# EAGLE design Armadino-v152 (EAGLE 5.07)
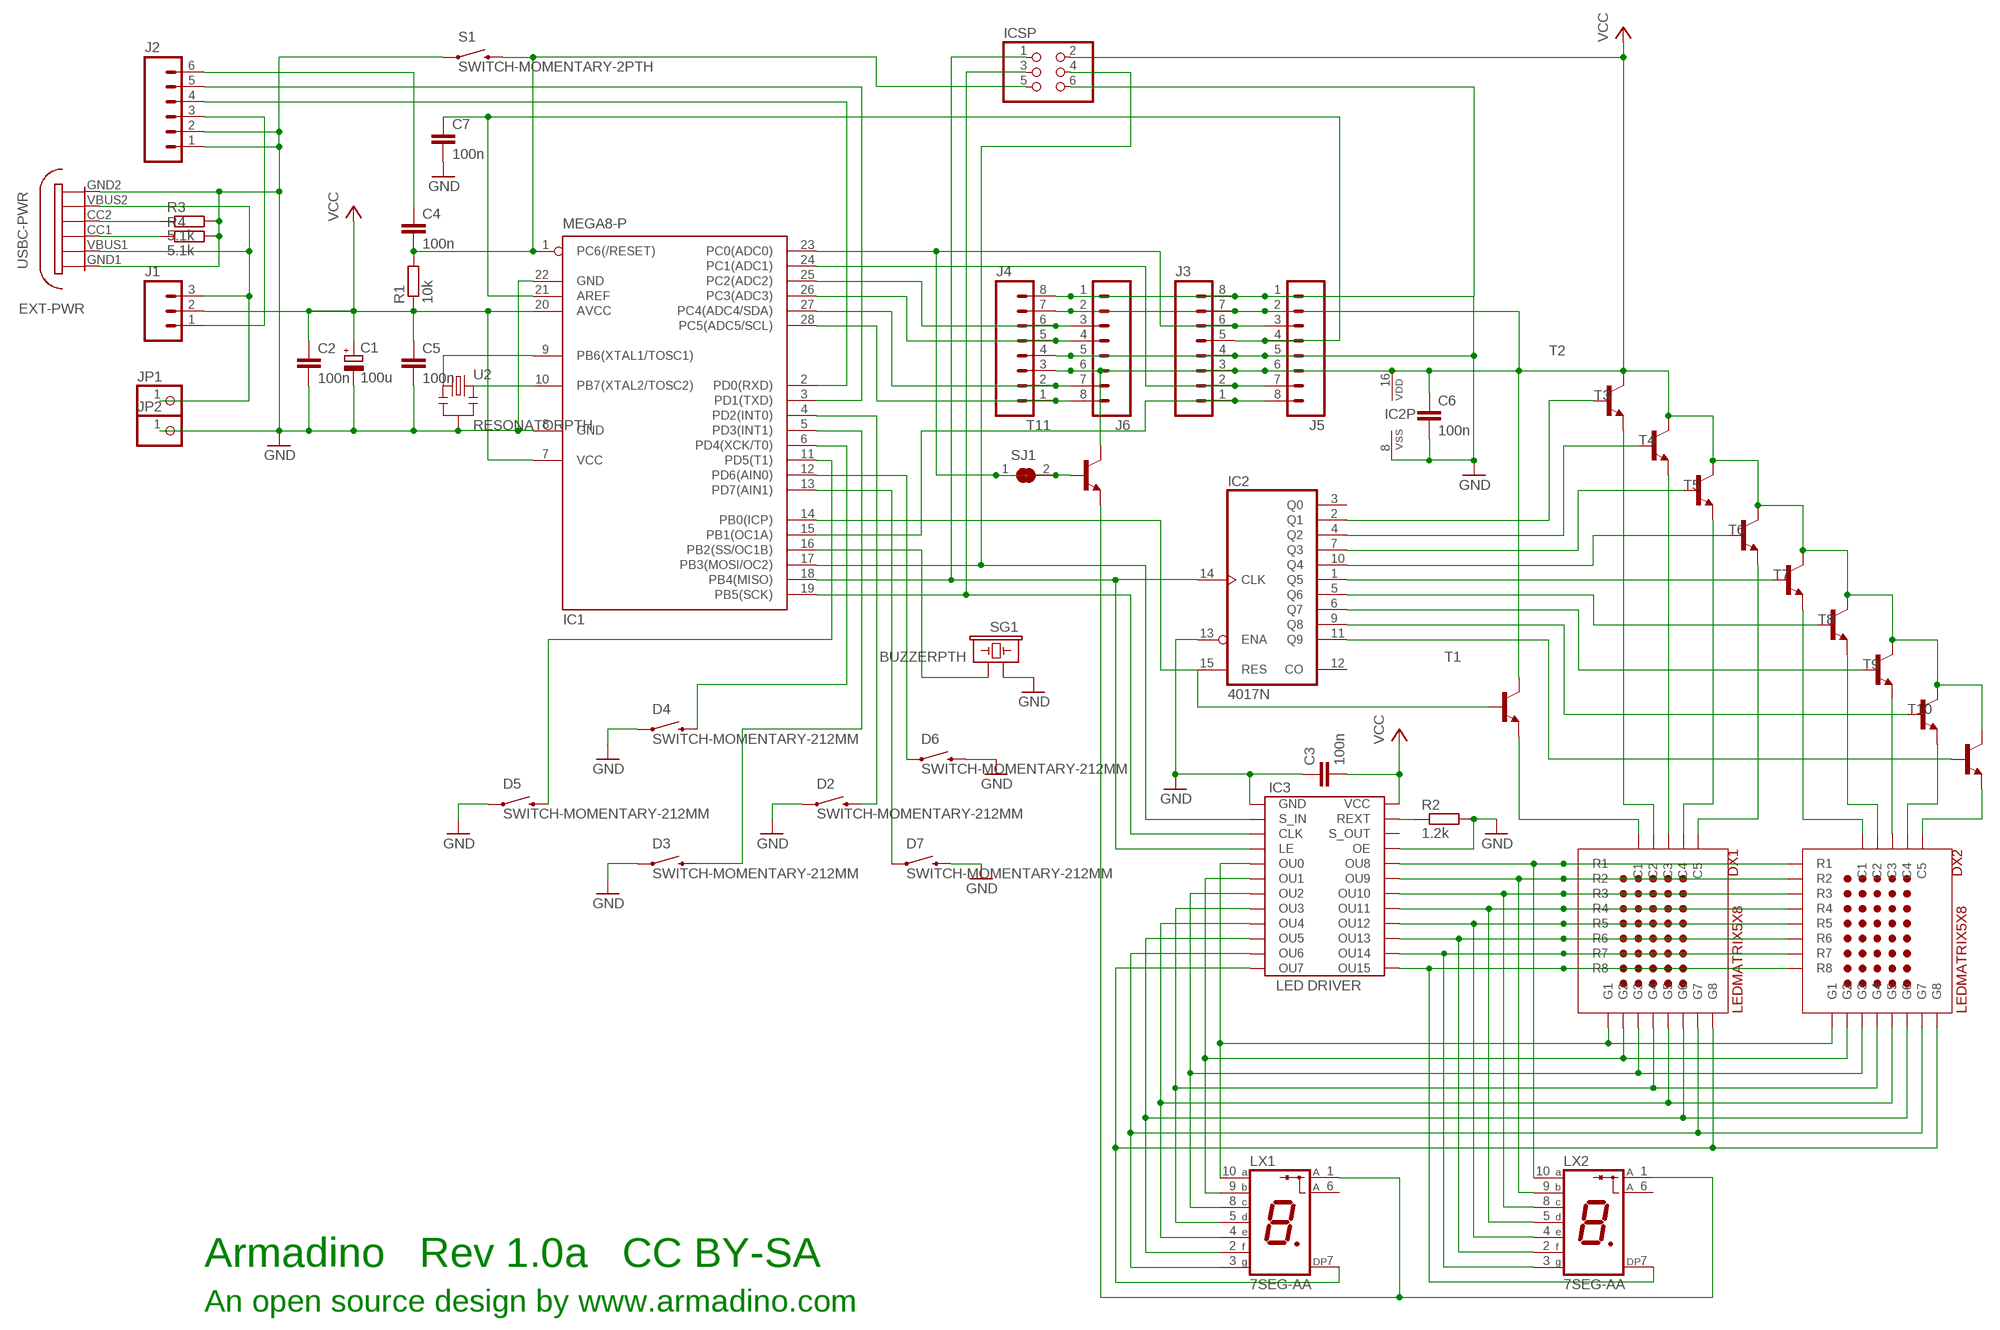
[diagram p0: schematic, sheet 1]

## Parts
C1  100u  CPOL-EUE2.5-6  [E2,5-6]
C2  100n  C-EU025-024X044  [C025-024X044]
C3  100n  C-EU025-024X044  [C025-024X044]
C4  100n  C-EU025-024X044  [C025-024X044]
C5  100n  C-EU025-024X044  [C025-024X044]
C6  100n  C-EU025-024X044  [C025-024X044]
C7  100n  C-EU025-024X044  [C025-024X044]
D2  SWITCH-MOMENTARY-212MM  [TACTILE-PTH-12MM]
D3  SWITCH-MOMENTARY-212MM  [TACTILE-PTH-12MM]
D4  SWITCH-MOMENTARY-212MM  [TACTILE-PTH-12MM]
D5  SWITCH-MOMENTARY-212MM  [TACTILE-PTH-12MM]
D6  SWITCH-MOMENTARY-212MM  [TACTILE-PTH-12MM]
D7  SWITCH-MOMENTARY-212MM  [TACTILE-PTH-12MM]
DX1  LEDMATRIX5X8  [LEDMATRIX5X8]
DX2  LEDMATRIX5X8  [LEDMATRIX5X8]
EXT-PWR  USBC-PWR  [VERTICAL-TH-PWR]
IC1  MEGA8-P  [DIL28-3]
IC2  4017N  [DIL16]
IC3  LED DRIVER  LEDDRIVER  [DIL24-3]
ICSP  PINHD-2X3  [2X03]
J1  M03LOCK  [1X03_LOCK]
J2  M06LOCK  [1X06_LOCK]
J3  M08LOCK  [1X08_LOCK]
J4  M08LOCK  [1X08_LOCK]
J5  M08LOCK  [1X08_LOCK]
J6  M08LOCK  [1X08_LOCK]
JP1  PINHD-1X1  [1X01]
JP2  PINHD-1X1  [1X01]
LX1  7SEG-AA  [LED-7SEG]
LX2  7SEG-AA  [LED-7SEG]
R1  10k  R-EU_0204/7  [0204/7]
R2  1.2k  R-EU_0204/7  [0204/7]
R3  5.1k  R-EU_0204/7  [0204/7]
R4  5.1k  R-EU_0204/7  [0204/7]
S1  SWITCH-MOMENTARY-2PTH  [TACTILE-PTH]
SG1  BUZZERPTH  [BUZZER-12MM]
SJ1  SJ  [SJ]
T1  -NPN-TO92-CBE  [TO92-CBE]
T2  -NPN-TO92-CBE  [TO92-CBE]
T3  -NPN-TO92-CBE  [TO92-CBE]
T4  -NPN-TO92-CBE  [TO92-CBE]
T5  -NPN-TO92-CBE  [TO92-CBE]
T6  -NPN-TO92-CBE  [TO92-CBE]
T7  -NPN-TO92-CBE  [TO92-CBE]
T8  -NPN-TO92-CBE  [TO92-CBE]
T9  -NPN-TO92-CBE  [TO92-CBE]
T10  -NPN-TO92-CBE  [TO92-CBE]
T11  -NPN-TO92-CBE  [TO92-CBE]
U2  RESONATORPTH  [RESONATOR-PTH]

## Nets
GND: C1.- C2.2 C3.1 C5.2 C6.2 C7.2 D2.1 D3.1 D4.1 D5.1 D6.3 D7.3 EXT-PWR.GND1 EXT-PWR.GND2 IC1.8(GND) IC1.22(GND) IC2.8(VSS) IC2.13(ENA) IC3.1(GND) IC3.21(OE) ICSP.6 J2.1 J2.2 J3.4 J3.8 J4.4 J4.8 J5.1 J5.5 J6.1 J6.5 JP2.1 R2.2 R3.2 R4.2 S1.1 SG1.+ U2.2
N$1: C7.1 IC1.21(AREF) J3.5 J5.4
N$2: DX1.8(C4) T4.E
N$3: DX1.22(R1) DX2.22(R1) IC3.13(OU8) LX2.10(A)
N$4: DX1.19(R2) DX2.19(R2) IC3.14(OU9) LX2.9(B)
N$5: DX1.16(R3) DX2.16(R3) IC3.15(OU10) LX2.8(C)
N$6: DX1.13(R4) DX2.13(R4) IC3.16(OU11) LX2.5(D)
N$7: DX1.3(R5) DX2.3(R5) IC3.17(OU12) LX2.4(E)
N$8: DX1.5(R6) DX2.5(R6) IC3.18(OU13) LX2.2(F)
N$9: IC2.2(Q1) T2.B
N$10: IC2.4(Q2) T3.B
N$11: IC2.7(Q3) T4.B
N$12: IC2.10(Q4) T5.B
N$13: IC2.1(Q5) T6.B
N$14: IC2.5(Q6) T7.B
N$15: IC2.6(Q7) T8.B
N$16: IC2.9(Q8) T9.B
N$17: IC2.11(Q9) T10.B
N$18: DX1.7(R7) DX2.7(R7) IC3.19(OU14) LX2.3(G)
N$19: DX1.10(R8) DX2.10(R8) IC3.20(OU15) LX2.7(DP)
N$20: DX1.21(G1) DX2.21(G1) IC3.5(OU0) LX1.10(A)
N$21: DX1.18(G2) DX2.18(G2) IC3.6(OU1) LX1.9(B)
N$22: DX1.14(G3) DX2.14(G3) IC3.7(OU2) LX1.8(C)
N$23: DX1.1(G4) DX2.1(G4) IC3.8(OU3) LX1.5(D)
N$24: DX1.2(G5) DX2.2(G5) IC3.9(OU4) LX1.4(E)
N$25: DX1.4(G6) DX2.4(G6) IC3.10(OU5) LX1.2(F)
N$26: DX1.6(G7) DX2.6(G7) IC3.11(OU6) LX1.3(G)
N$27: DX1.9(G8) DX2.9(G8) IC3.12(OU7) LX1.7(DP)
N$28: D4.3 IC1.6(PD4(XCK/T0))
N$29: D3.3 IC1.5(PD3(INT1))
N$30: D6.1 IC1.12(PD6(AIN0))
N$31: DX1.12(C5) T5.E
N$32: DX2.8(C4) T9.E
N$33: DX2.15(C3) T8.E
N$34: DX2.17(C2) T7.E
N$35: DX2.20(C1) T6.E
N$36: DX2.12(C5) T10.E
N$37: IC1.15(PB1(OC1A)) J3.1 J5.8
N$38: DX1.20(C1) T1.E
N$39: DX1.17(C2) T2.E
N$40: DX1.15(C3) T3.E
N$41: IC1.25(PC2(ADC2)) J4.6 J6.3
N$42: IC3.23(REXT) R2.1
N$43: IC1.16(PB2(SS/OC1B)) SG1.-
N$44: C4.1 J2.6
N$45: D7.1 IC1.13(PD7(AIN1))
N$46: J1.1 J2.3
N$47: IC1.26(PC3(ADC3)) J4.5 J6.4
N$48: EXT-PWR.VBUS1 EXT-PWR.VBUS2 J1.3 JP1.1
N$49: IC1.27(PC4(ADC4/SDA)) J4.2 J6.7
N$51: D5.3 IC1.11(PD5(T1))
N$52: IC1.18(PB4(MISO)) IC2.14(CLK) IC3.4(LE) ICSP.1
N$53: IC1.23(PC0(ADC0)) J3.6 J5.3 SJ1.1 SJ1.2 T11.B
N$54: IC1.24(PC1(ADC1)) J3.2 J5.7
N$55: IC1.28(PC5(ADC5/SCL)) J4.1 J6.8
N$56: C4.2 IC1.1(PC6(/RESET)) ICSP.5 R1.2 S1.3
N$57: EXT-PWR.CC1 R4.1
N$58: IC1.14(PB0(ICP)) IC2.15(RES) T1.B
N$59: EXT-PWR.CC2 R3.1
N$61: LX1.1(A) LX2.1(A) T11.E
N$62: IC1.17(PB3(MOSI/OC2)) IC3.2(S_IN) ICSP.4
N$67: D2.3 IC1.4(PD2(INT0))
N$68: IC1.19(PB5(SCK)) IC3.3(CLK) ICSP.3
N$77: IC1.2(PD0(RXD)) J2.4
N$80: IC1.3(PD1(TXD)) J2.5
N$85: IC1.10(PB7(XTAL2/TOSC2)) U2.3
N$89: IC1.9(PB6(XTAL1/TOSC1)) U2.1
VCC: C1.+ C2.1 C3.2 C5.1 C6.1 IC1.7(VCC) IC1.20(AVCC) IC2.16(VDD) IC3.24(VCC) ICSP.2 J1.2 J3.3 J3.7 J4.3 J4.7 J5.2 J5.6 J6.2 J6.6 R1.1 T1.C T2.C T3.C T4.C T5.C T6.C T7.C T8.C T9.C T10.C T11.C
Unconnected: IC2.3(Q0) IC2.12(CO) IC3.22(S_OUT) LX1.6(A) LX2.6(A)

## Notes on the sheet
- Armadino   Rev 1.0a   CC BY-SA
- An open source design by www.armadino.com

## Library data of the parts
C1 = resistor:CPOL-EU: POLARIZED CAPACITOR, European symbol
C2-C7 = resistor:C-EU: CAPACITOR, European symbol
D2-D7 S1 = SparkFun:SWITCH-MOMENTARY-2
DX1 DX2 = LEDMatrix_5x8:LEDMATRIX5X8: 5x8 Dual-Colour Dot Matrix LED Display
EXT-PWR = usbc:USBC-PWR
IC1 = atmel:MEGA8-P: MICROCONTROLLER 8 Kbytes FLASH, 1 kbytes SRAM, 512 bytes EEPROM, USART, 4-channel 10 bit ADC, 2-channel 8 bit ADC Pin compatible with Atmega48, ATMega88, ATMega168 Source: avr.lbr
IC2 = 40xx:4017: COUNTER/DIVIDER
IC3 = LEDdriver:LEDDRIVER: LED Driver
ICSP = pinhead:PINHD-2X3: PIN HEADER
J1 = SparkFun:M03: Header 3 Standard 3-pin 0.1" header. Use with straight break away headers (SKU : PRT-00116), right angle break away headers (PRT-00553), swiss pins (PRT-00743), machine pins (PRT-00117), and female headers (PRT-00115). Molex polarized connector foot print use with SKU : PRT-08232 with associated crimp pins and housings.
J2 = SparkFun:M06: Header 6 Standard 6-pin 0.1" header. Use with straight break away headers (SKU : PRT-00116), right angle break away headers (PRT-00553), swiss pins (PRT-00743), machine pins (PRT-00117), and female headers (PRT-00115). Molex polarized connector foot print use with SKU : PRT-08094 with associated crimp pins and housings. NOTES ON THE VARIANTS LOCK and LOCK_LONGPADS... This footprint was designed to help hold the alignment of a through-hole component (i.e. 6-pin header) while soldering it into place. You may notice that each hole has been shifted either up or down by 0.005 of an inch from it's more standard position (which is a perfectly straight line). This slight alteration caused the pins (the squares in the middle) to touch the edges of the holes. Because they are alternating, it causes a "brace" to hold the component in place. 0.005 has proven to be the perfect amount of "off-center" position when using our standard breakaway headers. Although looks a little odd when you look at the bare footprint, once you have a header in there, the alteration is very hard to notice. Also, if you push a header all the way into place, it is covered up entirely on the bottom side. This idea of altering the position of holes to aid alignment will be further integrated into the Sparkfun Library for other footprints. It can help hold any component with 3 or more connection pins.
J3-J6 = SparkFun:M08: Header 8 Standard 8-pin 0.1" header. Use with straight break away headers (SKU : PRT-00116), right angle break away headers (PRT-00553), swiss pins (PRT-00743), machine pins (PRT-00117), and female headers (PRT-00115).
JP1 JP2 = pinhead:PINHD-1X1: PIN HEADER
LX1 LX2 = led-7seg:7SEG-AA: Single Digit LED Numeric Display (anode common)
R1-R4 = resistor:R-EU_: RESISTOR, European symbol
SG1 = SparkFun:BUZZER: Buzzer 12mm Spark Fun Electronics SKU : Comp-Buzzer
SJ1 = jumper:SJ: SMD solder JUMPER
T1-T11 = transistor-neu-to92:*-NPN-: NPN Transistror
U2 = SparkFun:RESONATOR: Resonator Small SMD resonator. This is the itty bitty 10/20MHz resonators with built in caps. CSTCE10M0G55 and CSTCE20M0V53. Footprint has been reviewed closely but hasn't been tested yet.

## Board
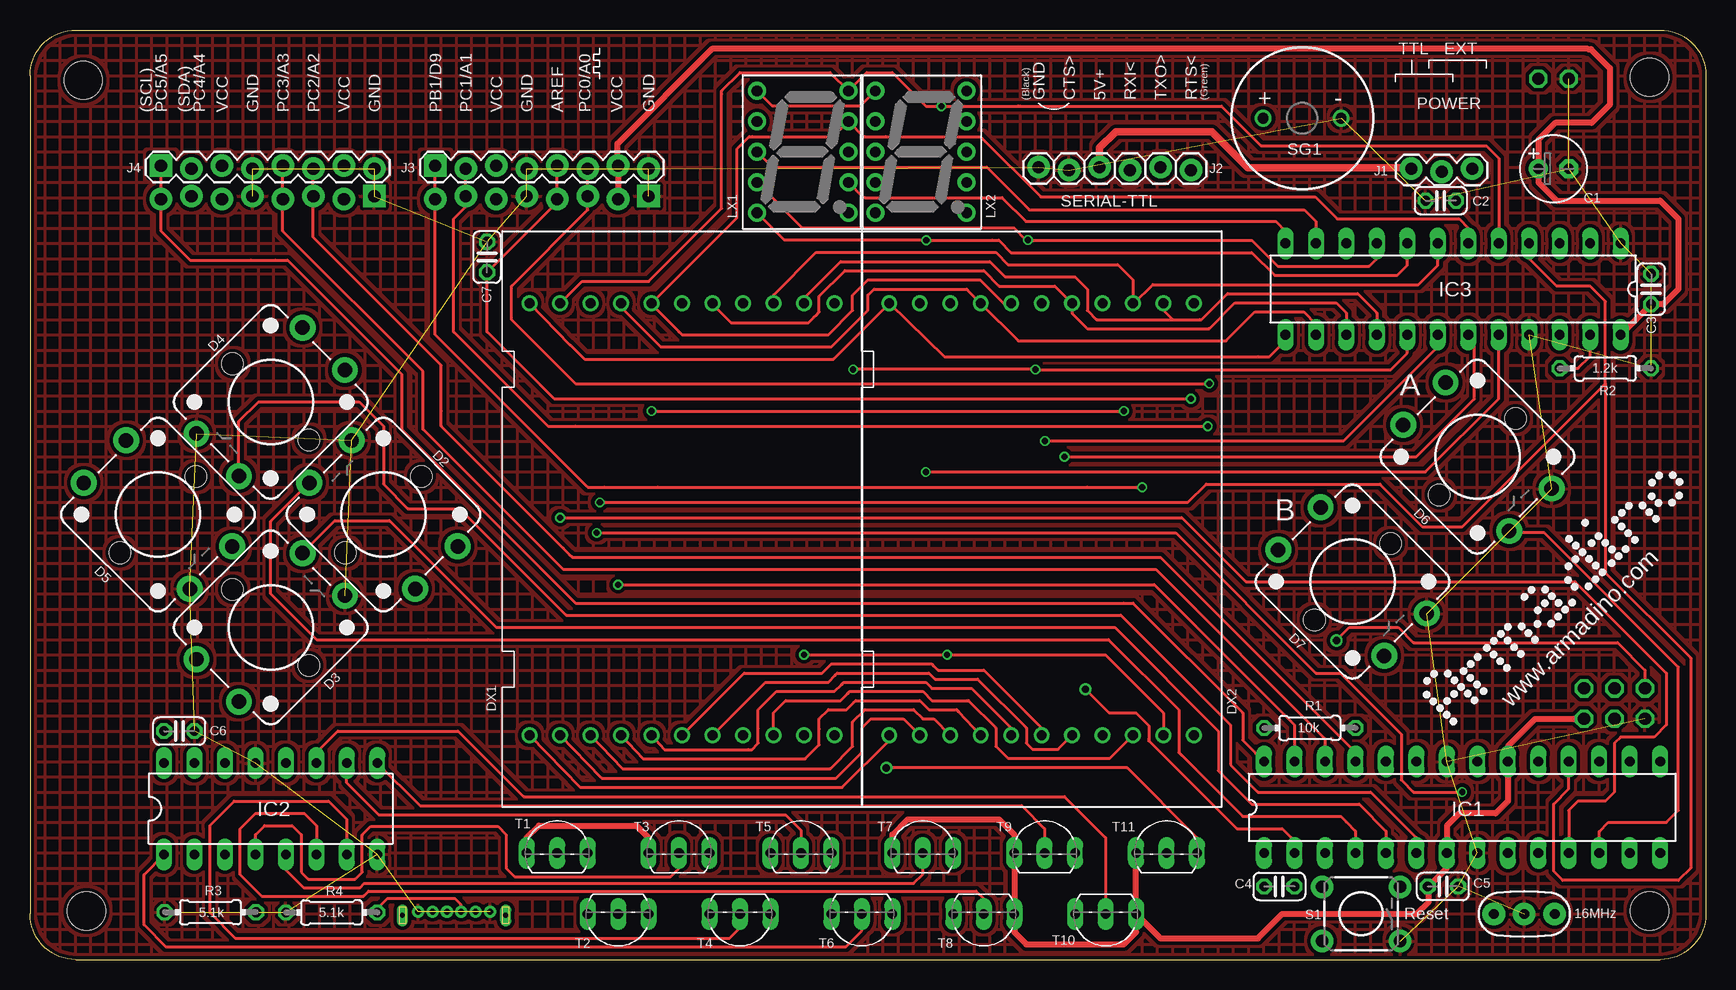
[diagram p1: board, top side]
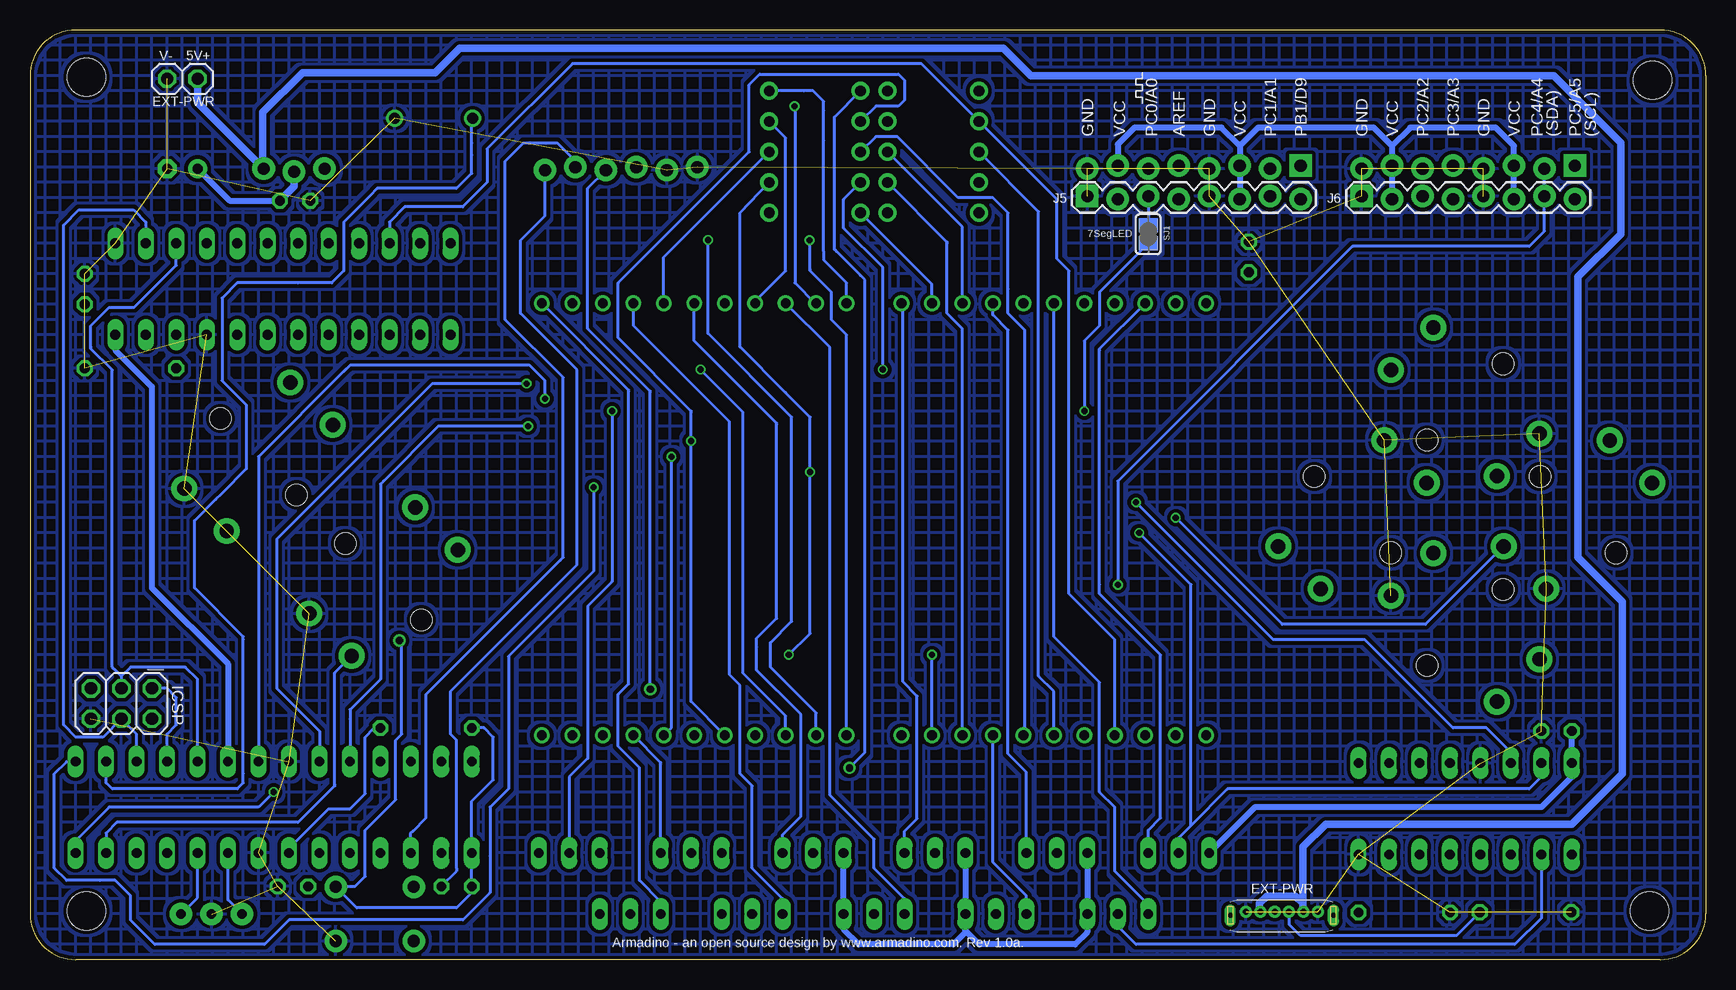
[diagram p2: board, bottom side, seen from below]

Size 139.7 x 77.47 mm. Coordinates in mm from the lower left corner, seen from the top.
Outline: 0,73.66 0,3.81 arc90 3.81,0 135.89,0 arc90 139.7,3.81 139.7,73.66 arc90 135.89,77.47 3.81,77.47 arc90 0,73.66
Copper layers (1*16): Top 0.035mm / dielectric 1.5mm / Bottom 0.035mm
Design rules "SeeedStudio_2layer_DRU_no_angle_20140221": minimum track width 6mil, minimum drill 12mil, track to track 6mil, track to pad 6mil, pad to pad 6mil, via to via 6mil, smd to smd 0mil, copper to edge 10mil, drill to drill 10mil, minimum pad ring 10mil, minimum via ring 6mil, stop-mask expansion 2mil, vias tented up to drill 100mil, thermal gap 10mil
Holes 3.17 mm at 135,4.06 135,73.53 4.45,73.28 4.7,4.06
Holes 1.78 mm at 16.89,49.66 23.24,43.31 16.89,30.86 23.24,24.51 13.84,40.26 7.49,33.91 26.29,33.91 32.64,40.26 113.41,34.67 107.06,28.32 117.47,38.73 123.83,45.09
vRestrict: area 0,62.2 to 58.4,78.7; area 77.5,62.2 to 137.2,78.7; area 58.4,74.9 to 77.5,78.7; area 29.2,1.3 to 99.1,14; area 99.1,1.3 to 137.2,10.2; area 0,1.3 to 29.2,5.1; area 0,55.9 to 38.1,62.2; area 0,14 to 38.1,22.9; area 0,11.4 to 29.2,14; area 0,5.1 to 8.9,11.4; area 99.1,16.5 to 137.2,24.1; area 99.1,50.8 to 137.2,54.6; 12 more areas
Milling: 8 lines

### Footprints (pad centres in the part's own frame; a part is rotated, then mirrored left to right if it is on the bottom)
E2,5-6 = drill 0.813 pad 1.6 round: + -1.27,0 | drill 0.813 pad 1.6 octagon: - 1.27,0
C025-024X044 = drill 0.813 octagon: 1 -1.27,0; 2 1.27,0
TACTILE-PTH-12MM = drill 1.2 pad 2.159 round: 1 6.25,-2.5; 2 -6.25,-2.5; 3 6.25,2.5; 4 -6.25,2.5
LEDMATRIX5X8 = drill 0.813 round: 1 -12.7,-18; 2 -10.16,-18; 3 -7.62,-18; 4 -5.08,-18; 5 -2.54,-18; 6 0,-18; 7 2.54,-18; 8 5.08,-18; 9 7.62,-18; 10 10.16,-18; 11 12.7,-18; 12 12.7,18; 13 10.16,18; 14 7.62,18; 15 5.08,18; 16 2.54,18; 17 0,18; 18 -2.54,18; 19 -5.08,18; 20 -7.62,18; 21 -10.16,18; 22 -12.7,18
VERTICAL-TH-PWR = drill 0.5 pad 0.75 round: CC1 3.7,0.28; CC2 4.9,0.28; GND1 1.3,0.28; GND2 7.3,0.28; VBUS1 2.5,0.28; VBUS2 6.1,0.28 | drill 0.4 pad 0.9 long: GND1-1 0,-0.02; GND2-1 8.6,-0.02
DIL28-3 = drill 0.813 long: 1 -16.51,-3.81; 2 -13.97,-3.81; 3 -11.43,-3.81; 4 -8.89,-3.81; 5 -6.35,-3.81; 6 -3.81,-3.81; 7 -1.27,-3.81; 8 1.27,-3.81; 9 3.81,-3.81; 10 6.35,-3.81; 11 8.89,-3.81; 12 11.43,-3.81; 13 13.97,-3.81; 14 16.51,-3.81; 15 16.51,3.81; 16 13.97,3.81; 17 11.43,3.81; 18 8.89,3.81; 19 6.35,3.81; 20 3.81,3.81; 21 1.27,3.81; 22 -1.27,3.81; 23 -3.81,3.81; 24 -6.35,3.81; 25 -8.89,3.81; 26 -11.43,3.81; 27 -13.97,3.81; 28 -16.51,3.81
DIL16 = drill 0.813 long: 1 -8.89,-3.81; 2 -6.35,-3.81; 3 -3.81,-3.81; 4 -1.27,-3.81; 5 1.27,-3.81; 6 3.81,-3.81; 7 6.35,-3.81; 8 8.89,-3.81; 9 8.89,3.81; 10 6.35,3.81; 11 3.81,3.81; 12 1.27,3.81; 13 -1.27,3.81; 14 -3.81,3.81; 15 -6.35,3.81; 16 -8.89,3.81
DIL24-3 = drill 0.813 long: 1 -13.97,-3.81; 2 -11.43,-3.81; 3 -8.89,-3.81; 4 -6.35,-3.81; 5 -3.81,-3.81; 6 -1.27,-3.81; 7 1.27,-3.81; 8 3.81,-3.81; 9 6.35,-3.81; 10 8.89,-3.81; 11 11.43,-3.81; 12 13.97,-3.81; 13 13.97,3.81; 14 11.43,3.81; 15 8.89,3.81; 16 6.35,3.81; 17 3.81,3.81; 18 1.27,3.81; 19 -1.27,3.81; 20 -3.81,3.81; 21 -6.35,3.81; 22 -8.89,3.81; 23 -11.43,3.81; 24 -13.97,3.81
2X03 = drill 1.016 octagon: 1 -2.54,-1.27; 2 -2.54,1.27; 3 0,-1.27; 4 0,1.27; 5 2.54,-1.27; 6 2.54,1.27
1X03_LOCK = drill 1.016 pad 1.88 round: 1 0,0.127; 2 2.54,-0.127; 3 5.08,0.127
1X06_LOCK = drill 1.016 pad 1.88 round: 1 0,0; 2 2.54,-0.254; 3 5.08,0; 4 7.62,-0.254; 5 10.16,0; 6 12.7,-0.254
1X08_LOCK = drill 1.016 pad 1.88 square: 1 0,0.127 | drill 1.016 pad 1.88 round: 2 2.54,-0.127; 3 5.08,0.127; 4 7.62,-0.127; 5 10.16,0.127; 6 12.7,-0.127; 7 15.24,0.127; 8 17.78,-0.127
1X01 = drill 1.016 octagon: 1 0,0
LED-7SEG = drill 0.9 pad 1.5 round: 1 -3.81,5.08; 2 -3.81,2.54; 3 -3.81,0; 4 -3.81,-2.54; 5 -3.81,-5.08; 6 3.81,-5.08; 7 3.81,-2.54; 8 3.81,0; 9 3.81,2.54; 10 3.81,5.08
0204/7 = drill 0.813 octagon: 1 -3.81,0; 2 3.81,0
TACTILE-PTH = drill 1.016 pad 1.88 round: 1 -3.251,2.261; 2 3.251,2.261; 3 -3.251,-2.261; 4 3.251,-2.261
BUZZER-12MM = drill 0.9 round: + 3.25,0; - -3.25,0
SJ = smd 1.168 x 1.6: 1 -0.762,0; 2 0.762,0
TO92-CBE = drill 0.813 long: B 0,0; C -2.54,0; E 2.54,0
RESONATOR-PTH = drill 0.8 pad 1.88 round: 1 -2.54,0; 2 0,0; 3 2.54,0

### Placement (x,y rotation side)
C1  127,65.91 0 top
C2  117.6,63.25 180 top
C3  135.13,55.88 270 top
C4  104.14,6.1 180 top
C5  117.78,6.1 0 top
C6  12.45,19.05 0 top
C7  38.1,58.55 90 top
D2  29.46,37.08 135 top
D3  20.07,27.69 45 top
D4  20.07,46.48 225 top
D5  10.67,37.08 315 top
D6  120.65,41.91 315 top
D7  110.24,31.5 315 top
DX1  54.36,36.7 0 top
DX2  84.33,36.7 0 top
EXT-PWR  39.65,3.71 0 bottom
IC1  119.38,12.7 0 top
IC2  20.07,12.57 0 top
IC3  118.62,55.88 180 top
ICSP  132.08,21.34 180 bottom
J1  115.14,65.79 0 top
J2  84.07,66.04 0 top
J3  33.78,66.04 0 top
J4  10.92,66.04 0 top
J5  51.56,63.5 0 bottom
J6  28.7,63.5 0 bottom
JP1  125.73,73.41 0 bottom
JP2  128.27,73.41 0 bottom
LX1  64.42,67.31 0 top
LX2  74.27,67.31 0 top
R1  106.68,19.3 180 top
R2  131.32,49.28 0 top
R3  15.04,3.95 180 top
R4  25.14,3.93 180 top
S1  110.96,3.81 180 top
SG1  106.05,70.1 0 top
SJ1  46.48,60.45 90 bottom
T1  43.94,8.89 0 top
T2  49.02,3.81 180 top
T3  54.1,8.89 0 top
T4  59.18,3.81 180 top
T5  64.26,8.89 0 top
T6  69.34,3.81 180 top
T7  74.42,8.89 0 top
T8  79.5,3.81 180 top
T9  84.58,8.89 0 top
T10  89.66,3.81 180 top
T11  94.74,8.89 0 top
U2  124.56,3.8 0 top

### Tracks (layer width: path | path; a pad name or v marks a point on that pad's centre or on a via)
GND  (37 unrouted)
  pour Bottom (isolate 0.305, hatched): 0,77.47 139.7,77.47 139.7,0 0,0
  pour Top (isolate 0.305, hatched): 0,77.47 139.7,77.47 139.7,0 0,0
N$1  (via drill 0.51)
  Top 0.254: J3.5 J5.4 43.94,63.12 C7.1 38.1,52.32 43.69,46.74 43.94,46.74 44.7,46.74 v96.77,46.74
  Bottom 0.254: IC1.21 120.65,41.91 113.54,49.02 | 113.54,49.02 113.41,49.15 | 113.41,49.15 113.28,49.28 113.41,49.15 | v96.77,46.74 96.77,48.26 98.04,49.53 113.03,49.53 113.54,49.02
N$2
  Bottom 0.254: DX1.8 59.44,8.13 56.64,5.33 T4.E
N$3
  Top 0.254: DX1.22 45,51.23 45.03,51.23 46.23,50.04 66.96,50.04 DX2.22 76.22,50.24 102.36,50.24 103.33,50.24 104.65,51.56 IC3.13
  Bottom 0.254: 77.69,72.39 LX2.10 75.18,72.39 74.42,72.39 73.55,71.52 73.55,70.75 73.55,68.25 73.55,59.03 73.53,59.01 73.53,58.29 71.75,56.52 71.63,56.39 DX2.22
N$4
  Top 0.254: IC3.14 107.19,52.96 106.17,53.98 102.11,53.98 99.69,51.56 82.52,51.56 82.39,51.56 DX2.19 78.15,55.8 | 78.15,55.8 78.07,55.88 | DX1.19 49.28,54.36 52.32,51.31 52.58,51.05 66.8,51.05 69.85,54.1 69.85,55.37 70.36,55.88 78.07,55.88 78.15,55.8
  Bottom 0.254: DX2.19 79.25,54.86 76.71,57.4 76.71,68.48 LX2.9
N$5
  Top 0.254: IC3.15 109.73,53.9 108.89,54.74 100.46,54.74 98.3,52.58 98.24,52.58 88.14,52.58 86.87,53.85 DX2.16 85.44,56.13 80.77,56.13 79.51,57.4 79.51,57.41 67.93,57.41 65.79,55.27 65.79,53.98 65.47,53.66 | 65.47,53.66 65.34,53.53 | DX1.16 56.9,54.61 58.42,53.09 64.9,53.09 65.47,53.66
  Bottom 0.254: LX2.8 78.11,67.31 86.87,58.55 DX2.16
N$6
  Top 0.254: IC3.16 112.27,53.9 110.67,55.5 99.82,55.5 97.66,53.34 97.52,53.34 95.25,53.34 | 95.25,53.34 88.9,53.34 88.14,54.1 88.14,55.88 87.12,56.9 81.28,56.9 80.01,58.17 67.56,58.17 64.52,55.12 DX1.13 | DX2.13 94.49,54.1 95.25,53.34
  Bottom 0.254: DX1.13 64.52,56.29 LX2.5
N$7  (via drill 0.51)
  Top 0.254: DX1.3 49.38,15.93 66.73,15.93 68.58,17.78 68.58,19.81 69.6,20.83 73.66,20.83 74.42,20.07 75.34,20.07 DX2.3 | v68.61,49.18 v83.8,49.18 v83.81,49.18 113.44,49.18 114.81,50.55 IC3.17
  Bottom 0.254: v83.81,49.18 80.26,45.63 80.26,23.88 76.71,20.32 DX2.3 | LX2.4 71.88,63.35 71.88,60.96 68.61,57.69 v68.61,49.18
N$8  (via drill 0.51)
  Top 0.254: DX1.5 52.89,17.5 59.85,17.5 60.17,17.5 60.71,18.03 60.71,19.28 60.71,20.83 62.23,22.35 67.06,22.35 67.63,22.92 67.82,23.11 74.54,23.11 74.68,23.11 75.18,22.61 78.36,22.61 78.49,22.61 81.79,19.3 DX2.5 | v84.61,43.22 100.12,43.22 109.52,43.22 117.35,51.05 IC3.18
  Bottom 0.254: DX2.5 84.61,21.52 v84.61,43.22 84.58,43.25 84.58,45.59 84.58,45.72 90.68,51.82 90.68,56.39 79.76,67.31 79.76,72.9 78.87,73.79 67.31,73.79 66.8,73.28 66.8,71.63 67.31,71.12 67.77,71.12 69.09,71.12 69.19,71.12 LX2.2
N$9
  Bottom 0.254: T2.B 49.02,2.79 47.5,1.27 15.93,1.27 13.7,3.5 13.7,8.75 IC2.2
N$10
  Top 0.254: T3.B 54.1,7.62 53.38,6.9 40.4,6.9 39.7,7.6 39.7,10.4 39,11.1 28.4,11.1 27.7,10.4 27.7,7.3 27.1,6.7 23.2,6.7 22.61,7.29 22.61,10.41 21.84,11.18 19.56,11.18 18.8,10.41 IC2.4
N$11
  Top 0.254: T4.B 59.18,2.67 58.29,1.78 17.12,1.78 15,3.9 15,11.16 14.99,11.18 17.02,13.21 24.89,13.21 26.42,11.68 IC2.7
N$12
  Top 0.254: T5.B 64.26,10.79 62.99,12.06 29.08,12.06 26.42,14.73 IC2.10
N$13
  Top 0.254: T6.B 69.34,2.41 68,1.07 11.33,1.07 9.5,2.9 9.5,7.09 IC2.1
N$14
  Top 0.254: T7.B 74.42,7.11 73.66,6.35 27.85,6.35 27.5,6 22.8,6 21.3,7.5 21.3,8.73 IC2.5
N$15
  Top 0.254: T8.B 79.5,5.08 78.87,5.71 28.21,5.71 27.8,5.3 19.3,5.3 17.53,7.07 17.53,10.92 18.8,12.19 22.86,12.19 23.88,11.18 IC2.6
N$16
  Top 0.254: T9.B 84.58,10.92 82.68,12.83 32.51,12.83 IC2.9
N$17
  Top 0.254: T10.B 89.66,10.16 86.23,13.59 41.15,13.59 35.69,19.05 25.65,19.05 23.88,17.27 IC2.11
N$18  (via drill 0.51)
  Top 0.254: IC3.19 120.4,51.56 120.4,46.74 115.57,41.91 v86.23,41.91 | DX1.7 61.31,23.11 66.55,23.11 67.12,23.68 67.31,23.88 74.93,23.88 75.44,23.37 78.98,23.37 78.99,23.37 83.06,19.3 83.06,18.03 83.57,17.53 85.69,17.53 DX2.7
  Bottom 0.254: DX1.7 56.77,18.83 56.77,52.45 58.17,53.85 58.17,55.88 58.17,62.23 59.44,63.5 59.94,63.5 60.19,63.5 62.33,63.5 67.41,68.58 69.09,68.58 69.19,68.58 LX2.3 | v86.23,41.91 86.23,19.46 86.23,19.34 DX2.7
N$19  (via drill 0.51)
  Top 0.254: v64.52,25.4 65.02,25.4 v76.45,25.4 89.66,25.4 94.49,20.57 DX2.10 | v74.68,40.64 83.09,40.64 87.88,40.64 116.33,40.64 122.43,46.74 122.43,47.24 IC3.20
  Bottom 0.254: DX1.10 v64.52,25.4 | v76.45,25.4 74.68,27.18 v74.68,40.64 74.68,45.21 76.45,46.99 76.71,47.24 80.52,51.05 80.52,62.23 LX2.7
N$20  (via drill 0.51)
  Top 0.254: DX1.21 46.02,56.53 51.58,56.53 57.66,62.61 57.66,72.14 57.66,72.39 59.18,73.91 66.7,73.91 LX1.10 69.75,73.91 71.88,73.91 74.69,71.11 74.73,71.11 v75.97,71.11 v75.98,71.12 77.47,71.12 82.33,71.12 82.42,71.12 82.55,71.12 99.31,71.12 102.62,67.82 121.41,67.82 122.43,66.8 IC3.5
  Bottom 0.254: DX2.21 74.26,54.7 75.95,56.39 75.95,70.87 v75.97,71.11
N$21
  Top 0.254: DX2.18 81.14,54.7 79.19,56.65 79.19,56.64 69.85,56.64 68.58,55.37 68.58,54.1 66.55,52.07 54.36,52.07 54.1,52.32 51.82,54.61 DX1.18 58.93,61.81 58.93,67.56 59.94,68.58 60.19,68.58 66.95,68.58 LX1.9 69.5,68.58 69.6,68.58 71.35,68.58 79.25,68.58 84.27,63.56 85.24,63.56 106.72,63.56 107.13,63.56 108.97,61.72 119.13,61.72 119.89,60.96 IC3.6
N$22
  Top 0.254: IC3.7 117.35,57.86 115.75,56.26 93.6,56.26 92.04,54.7 DX2.14 91.95,54.83 91.95,56.64 90.68,57.91 81.53,57.91 80.51,58.93 80.14,58.93 66.08,58.93 65.54,58.93 61.98,55.37 DX1.14
  Bottom 0.254: DX1.14 61.98,60.96 61.98,61.06 LX1.8
N$23  (via drill 0.51)
  Top 0.254: DX1.1 45.87,14.36 67.28,14.36 67.7,14.36 71.63,18.29 DX2.1 | IC3.8 114.81,57.86 113.97,57.02 103.76,57.02 101.85,58.93 101.84,58.93 81.79,58.93 80.77,59.95 80.2,59.95 v74.71,59.95 62.99,59.95 62.88,59.95 LX1.5
  Bottom 0.254: v74.71,59.95 74.68,59.92 74.68,57.53 74.68,57.4 72.9,55.63 72.9,53.34 71.63,52.07 DX2.1
N$24  (via drill 0.51)
  Top 0.254: DX1.2 47.65,15.12 67.19,15.12 69.34,17.27 69.34,19.3 70.1,20.07 72.81,20.07 DX2.2 | IC3.9 112.27,58.42 111.63,57.78 104.01,57.78 101.85,59.94 83.2,59.94 v83.18,59.97 83.03,59.97 82.04,60.96 64.42,60.96 LX1.4
  Bottom 0.254: 83.13,60.02 v83.18,59.97 v83.19,59.96 83.19,52.2 76.2,45.21 76.2,28.19 77.98,26.42 77.98,24.38 74.17,20.57 DX2.2
N$25
  Top 0.254: DX1.4 51.12,16.74 64.09,16.74 64.61,16.74 65.79,17.91 65.79,19.21 65.79,20.07 66.55,20.83 68.07,20.83 68.64,21.4 68.83,21.59 74.17,21.59 74.93,20.83 77.25,20.83 77.41,20.67 DX2.4
  Bottom 0.254: IC3.10 109.73,61.47 108.46,62.74 103.63,62.74 101.6,64.77 101.6,67.56 94.49,74.68 65.41,74.68 60.6,69.88 LX1.2 54.1,63.35 54.1,58.42 53.09,57.4 53.09,30.48 49.28,26.67 DX1.4
N$26
  Top 0.254: IC3.11 107.19,61.52 106.22,62.48 83.31,62.48 79.76,66.04 61.88,66.04 LX1.3 | DX1.6 59.53,23.88 66.04,23.88 66.8,24.64 75.17,24.64 75.36,24.45 75.38,24.45 75.69,24.13 79.5,24.13 84.33,19.3 DX2.6
  Bottom 0.254: DX1.6 54.36,22.35 55.63,23.62 55.63,62.33 LX1.3
N$27
  Top 0.254: IC3.12 104.65,60.71 103.83,61.52 83.37,61.52 83.01,61.52 81.03,63.5 69.6,63.5 69.5,63.5 LX1.7 | DX1.9 61.98,20.57 62.99,21.59 67.56,21.59 68.14,22.16 68.33,22.35 74.42,22.35 75.18,21.59 78.14,21.59 78.23,21.59 80.52,19.3 80.52,17.78 81.53,16.76 90.01,16.76 DX2.9
  Bottom 0.254: DX1.9 61.98,20.19 61.98,52.58 63.25,53.85 63.25,59.69 63.25,59.79 LX1.7
N$28
  Top 0.254: IC1.6 115.57,10.16 111.76,13.97 102.36,13.97 100.08,16.26 100.08,19.56 90.93,28.7 44.7,28.7 35.81,37.59 31.5,37.59 29.46,39.62 29.46,44.45 27.43,46.48 19.05,46.48 17.41,44.85 D4.3
N$29
  Top 0.254: IC1.5 113.03,10.72 110.8,12.95 101.85,12.95 99.06,15.75 99.06,19.05 90.42,27.69 38.86,27.69 29.97,36.58 25.4,36.58 22.72,33.89 D3.3
N$30
  Top 0.254: IC1.12 130.81,10.41 130.81,10.67 131.57,11.43 136.4,11.43 137.41,12.45 137.41,24.38 126.24,35.56 123.46,35.56 D6.1
N$31
  Bottom 0.254: T5.E 66.8,10.72 65.76,11.76 65.76,21.97 66.93,23.14 66.93,54.58 DX1.12
N$32
  Bottom 0.254: T9.E 87.12,16.29 87.12,16.42 DX2.8
N$33
  Bottom 0.254: DX2.15 89.41,52.83 81.41,44.83 81.41,23.75 80.52,22.86 80.52,15.49 79.5,14.48 79.5,7.62 76.96,5.08 T8.E
N$34
  Bottom 0.254: T7.E 76.96,10.41 75.65,11.72 75.44,11.94 75.44,20.45 75.65,20.66 79.12,24.13 79.12,26.04 79.12,26.8 77.47,28.45 77.47,44.58 77.47,44.7 84.33,51.56 DX2.17
N$35
  Bottom 0.254: DX2.20 73.03,51.02 73.03,13.72 69.34,10.03 69.34,7.62 66.8,5.08 T6.E
N$36
  Bottom 0.254: T10.E 87.12,4.83 88.9,6.6 88.9,16 89.15,16.26 90.68,17.78 90.68,22.1 89.79,22.99 89.79,47.34 89.79,47.46 DX2.12
N$37  (via drill 0.51)
  Top 0.254: J3.1 J5.8 33.78,53.59 33.78,52.07 46.48,39.37 47.88,39.37 52.32,39.37 88.14,39.37 v92.71,39.37
  Bottom 0.254: v92.71,39.37 92.71,32.38 93.09,32 99.82,25.27 99.82,14.22 101.35,12.7 101.35,8.64 101.35,5.59 102.36,4.57 103.61,3.32 118.09,3.32 120.14,1.27 129.29,1.27 131.32,3.3 131.32,5.33 132.59,6.6 133.86,6.6 136.65,6.6 137.67,7.62 137.67,15.49 136.65,16.51 IC1.15
N$38
  Bottom 0.254: T1.E 46.48,10.72 46.48,10.79 45.47,11.81 45.47,25.4 50.55,30.48 50.55,31.24 50.55,50.77 50.55,50.89 DX1.20
N$39
  Bottom 0.254: T2.E 46.48,4.57 49.28,7.37 49.28,12.7 50.55,13.97 50.55,23.11 54.23,26.8 54.36,26.92 DX1.17
N$40
  Bottom 0.254: DX1.15 59.44,53.72 58.17,52.45 58.17,17.14 56.64,15.62 T3.E
N$41
  Top 0.254: J4.6 J6.3 23.62,60.2 34.29,49.53 34.29,45.72 34.29,44.45 44.45,34.29 44.96,33.78 45.21,33.53 94.23,33.53 110.49,17.27 IC1.25
N$42
  Top 0.254: IC3.23 130.05,50.29 129.03,49.28 R2.1
N$43
  Bottom 0.254: IC1.16 133.35,15.49 133.35,14.73 132.84,14.22 122.43,14.22 121.92,14.73 121.92,15.49 121.92,26.67 121.92,26.92 125.98,30.99 125.98,36.58 124.21,38.35 123.7,38.86 121.67,40.89 121.67,46.23 123.7,48.26 123.7,55.12 122.43,56.39 117.35,56.39 114.55,56.39 113.54,57.4 113.54,61.21 113.54,61.47 111.38,63.63 | 111.38,63.63 111.25,63.75 | SG1.- 102.87,70.03 102.87,68.07 102.87,67.06 102.87,65.53 104.14,64.26 110.74,64.26 111.38,63.63
N$44
  Bottom 0.254: J2.6 96.77,61.98 98.81,59.94 98.81,53.85 94.11,49.15 94.11,32.89 94.23,32.77 104.14,22.86 104.65,22.35 104.65,18.8 104.14,18.29 104.14,7.62 104.14,7.37 C4.1
N$45
  Bottom 0.254: IC1.13 133.35,10.54 132.46,11.43 117.35,11.43 114.3,14.48 114.3,14.61 114.3,23.9 D7.1
N$46
  Top 0.61: J2.3 89.15,67.65 90.5,69 98.5,69 101.5,66 115.06,66 J1.1
N$47
  Top 0.254: J4.5 J6.4 21.08,60.71 32.77,49.02 32.77,45.21 32.77,44.2 43.69,33.27 44.2,32.77 44.45,32.51 93.85,32.51 107.95,18.41 IC1.26
N$48
  Bottom 0.61: 33.6,4.7 33.6,9.4 31.7,11.3 11.18,11.3 6.99,15.49 6.99,29.84 10.67,33.53 10.67,56.9 7.11,60.45 7.11,68.07 12.7,73.66 56.26,73.66 58.55,75.95 103.89,75.95 105.92,73.91 116.99,73.91 120.3,70.6 120.3,65.99 J1.3 125.73,71.42 JP1.1 | EXT-PWR.VBUS2 33.6,4.04 33.6,4.7 | 33.6,4.7 34.2,5.3 36.6,5.3 37.2,4.7 37.2,4.04 EXT-PWR.VBUS1
N$49  (via drill 0.51)
  Top 0.254: IC1.27 105.41,19.56 93.73,31.24 v49.02,31.24
  Bottom 0.254: J4.2 J6.7 13.46,60.71 14.73,59.44 29.46,59.44 49.02,39.88 v49.02,31.24
N$51  (via drill 0.51)
  Top 0.254: IC1.11 128.27,12.45 129.03,13.21 131.32,13.21 132.08,13.97 132.08,18.03 132.59,18.54 135.38,18.54 136.4,19.56 136.4,23.88 128.78,31.5 101.35,31.5 96.01,36.83 v44.2,36.83
  Bottom 0.254: D5.3 16.88,34.43 23.37,27.94 35.31,27.94 v44.2,36.83
N$52  (via drill 0.51)
  Top 0.254: IC1.18 128.27,14.22 127,12.95 127,7.37 127.76,6.6 137.41,6.6 138.43,7.62 138.43,25.15 131.32,32.26 131.32,48.01 | IC3.4 124.97,58.42 127.25,56.13 130.05,56.13 131.32,54.86 131.32,48.01 | 131.32,48.01 119.38,36.07 116.08,36.07 112.52,39.62 98.04,39.62 96.52,38.1 v47.5,38.1
  Bottom 0.254: IC1.18 128.27,18.8 127.51,19.56 127.51,21.84 128.27,22.61 ICSP.1 | IC2.14 16.26,17.27 18.29,19.3 21.08,19.3 28.45,26.67 36.07,26.67 v47.5,38.1 47.24,38.1
N$53  (via drill 0.51)
  Top 0.254: J3.6 J5.3 46.48,62.48 40.13,56.13 40.13,53.34 45.47,48.01 v98.3,48.01 | v51.82,45.72 v91.19,45.72
  Bottom 0.254: IC1.23 115.57,19.05 119.13,22.61 119.13,35.05 106.17,48.01 v98.3,48.01 | T11.B 94.74,15.24 93.22,16.76 93.22,29.46 91.19,31.5 v91.19,45.72 | v51.82,45.72 51.82,51.56 50.55,52.83 50.55,55.63 SJ1.1 SJ1.2 J5.3
N$54  (via drill 0.51)
  Top 0.254: J3.2 J5.7 36.32,62.74 35.31,61.72 35.31,52.32 36.32,51.31 43.18,44.45 45.47,44.45 v98.17,44.45
  Bottom 0.254: IC1.24 113.03,20.07 113.03,20.83 110.49,23.37 110.49,39.62 110.24,39.88 105.66,44.45 v98.17,44.45
N$55
  Top 0.254: J4.1 J6.8 10.92,60.71 13.34,58.29 18.41,58.29 20.45,58.29 21.46,58.29 30.99,48.77 30.99,44.96 30.99,44.2 44.45,30.73 45.47,29.72 91.19,29.72 91.95,29.72 101.09,20.57 101.09,18.29 101.35,18.03 IC1.28
N$56  (via drill 0.61 pad 1.02)
  Top 0.254: ICSP.5 134.62,24.13 132.33,26.42 115.32,26.42 114.05,27.69 109.99,27.69 v108.9,26.6
  Bottom 0.254: R1.2 101.85,19.3 101.09,18.54 101.09,14.99 102.87,13.21 IC1.1 C4.2 102.87,5.59 104.14,4.32 112.46,4.32 S1.3 114.18,6.1 112.6,6.1 111.76,6.94 111.76,10.79 109.22,13.34 109.22,18.29 108.71,18.8 108.71,26.41 v108.9,26.6
N$57
  Top 0.254: R4.1 28.95,4.25 29.8,5.1 35.4,5.1 35.9,4.6 35.9,4.04 EXT-PWR.CC1
N$58  (via drill 0.51)
  Top 0.254: v47.24,35.56 95.5,35.56 107.19,23.88 109.22,23.88 114.3,18.8 114.3,14.99 115.32,13.97 v119.38,13.97
  Bottom 0.254: T1.B 43.94,10.16 42.93,11.18 | IC1.14 135.89,9.91 133.1,12.7 120.65,12.7 v119.38,13.97 | 42.93,11.18 42.93,31.24 v47.24,35.56 | IC2.15 13.72,15.24 14.73,14.22 39.88,14.22 42.93,11.18
N$59
  Bottom 0.254: R3.1 20.8,2 33.8,2 34.7,2.9 34.7,3.94 EXT-PWR.CC2
N$61  (via drill 0.61 pad 1.02)
  Top 0.254: T11.E 97.28,10.16 91.46,15.98 v71.39,15.98 | LX2.1 69.19,71.12 61.88,71.12 LX1.1
  Bottom 0.254: LX2.1 72.64,70.2 72.64,59.18 72.42,58.96 72.41,58.96 70.48,57.04 70.48,57.02 70.1,56.64 70.1,17.26 v71.39,15.98
N$62
  Bottom 0.254: IC1.17 130.81,18.8 ICSP.4 133.6,18.54 135.89,18.54 136.91,19.56 136.91,61.21 135.64,62.48 131.06,62.48 130.05,61.47 IC3.2
N$67
  Top 0.254: IC1.4 110.49,10.72 109.73,11.48 109.27,11.94 102.11,11.94 101.09,11.94 96.01,17.02 95.89,17.14 95.76,17.27 95.76,20.83 89.92,26.67 33.15,26.67 23.88,26.67 20.07,30.48 20.07,36.52 D2.3
N$68
  Bottom 0.254: IC3.3 127.51,57.86 131.01,54.36 133.1,54.36 134.62,52.83 134.62,51.05 134.62,50.93 132.84,49.15 132.84,24.38 | IC1.19 125.73,23.37 126.75,24.38 131.32,24.38 132.08,23.62 | 132.08,23.62 ICSP.3 | 132.08,23.62 132.52,24.07 | 132.52,24.07 132.84,24.38 | 132.52,24.07 132.84,24.38
N$77  (via drill 0.61 pad 1.02)
  Top 0.254: IC1.2 105.41,9.91 104.39,10.92 100.58,10.92 93.27,18.24 93.27,18.39 93.27,19.51 92.2,20.57 90.84,20.57 89.95,20.57 v87.99,22.54
  Bottom 0.254: v87.99,22.54 88.01,22.57 88.01,47.24 88.01,47.37 93.22,52.58 93.22,64.26 J2.4
N$80
  Bottom 0.254: IC1.3 107.95,10.54 107.77,10.72 106.68,11.81 106.68,20.32 106.68,20.83 106.68,22.1 95.5,33.27 95.25,33.53 95.25,48.51 100.08,53.34 100.08,66.55 98.55,68.07 95.76,68.07 94.23,66.55 J2.5
N$85
  Bottom 0.254: IC1.10 125.73,5.17 U2.3
N$89
  Bottom 0.254: IC1.9 123.19,4.97 U2.1
VCC
  Top 0.254: 116.6,6.01 C5.1 116.6,6.1 | IC1.7
  Top 0.508: T10.C T11.C | J5.2 J3.7 48.96,66.23 48.96,68.01 56.9,75.95 129.79,75.95 129.86,75.88 130.11,75.88 131.7,74.3 131.7,71.25 130.18,69.72 127.13,69.72 125.73,68.33 C1.+ 125.73,64.77 127.25,63.25 135.89,63.25 137.41,61.72 137.41,55.88 136.14,54.61 C3.2 IC3.24 | IC1.7 118.11,11.18 119.13,12.19 122.17,12.19 123.19,13.21 IC1.20 123.19,17.78 125.48,20.07 ICSP.2 | T10.C 94.23,1.78 102.36,1.78 104.39,3.81 115.61,3.81 116.6,4.8 116.6,6.01 | T10.C 92.2,2.29 91.19,1.27 83.06,1.27 82.04,2.29 T8.C T9.C 82.04,10.41 80.77,11.68 73.15,11.68 71.88,10.41 T7.C | T3.C 51.56,10.16 50.55,11.18 42.42,11.18 41.4,10.16 T1.C | 116.6,6.1 118.1,7.6 IC1.7
  Bottom 0.254: R1.1 111,19.3 111.76,18.54 111.76,13.84 113.03,12.57 114.81,12.57 118.11,9.27 IC1.7
  Bottom 0.406: T5.C T4.C 61.72,2.41
  Bottom 0.508: T7.C T6.C 71.88,2.54 70.61,1.27 62.74,1.27 61.72,2.29 T5.C | IC3.24 132.59,50.8 129.54,47.75 129.54,30.99 123.19,24.64 IC1.20 | C2.1 123.06,63.25 C1.+ | J6.6 J4.3 16,67.82 17.53,69.34 24.64,69.34 26.16,67.82 | 38.86,67.82 J3.3 J5.6 | 38.86,67.82 37.34,69.34 27.69,69.34 26.16,67.82 | J6.2 J4.7 26.16,67.82 | T3.C T2.C 51.56,2.29 52.58,1.27 60.58,1.27 61.72,2.41 | C6.1 IC2.16 11.18,15.24 13.72,12.7 37.59,12.7 T1.C | 38.86,67.82 40.39,69.34 47.62,69.34 49.02,67.94 J3.7
  Bottom 0.61: J1.2 117.68,64.44 C2.1

### Text on the board
tPlace: TTL | EXT | (Black) | GND | CTS> | 5V+ | RXI< | TXO> | RTS< | (Green) | (SCL) | PC5/A5 | (SDA) | PC4/A4 | VCC | GND | PC3/A3 | PC2/A2 | VCC | GND | PB1/D9 | PC1/A1 | VCC | GND | AREF | PC0/A0 | VCC | GND | + | - | POWER | SERIAL-TTL | D4 | 1.2k | A | D2 | B | D6 | D5 | D7 | D3 | www.armadino.com | 10k | 5.1k | 5.1k
bPlace: 5V+ | V- | EXT-PWR | (SCL) | PC5/A5 | (SDA) | PC4/A4 | VCC | GND | PC3/A3 | PC2/A2 | VCC | GND | PB1/D9 | PC1/A1 | VCC | GND | AREF | PC0/A0 | VCC | GND | 7SegLED | _ | Armadino - an open source design by www.armadino.com. Rev 1.0a.
tNames: Reset | 16MHz
Document: Armadino Rev 1.0a CC BY-SA | An open source design by www.armadino.com